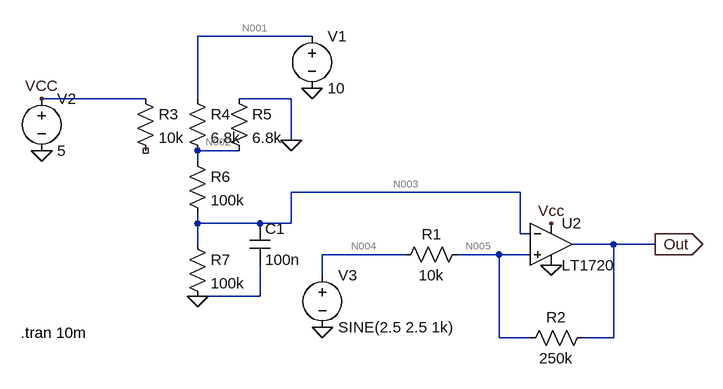
[diagram p0: schematic ConfNInv.asc]
ConfNInv.asc, the LTspice schematic file:
Version 4
SHEET 1 1800 752
WIRE 208 -96 32 -96
WIRE -48 0 -208 0
WIRE 32 0 32 -96
WIRE 176 0 96 0
WIRE 176 64 176 0
WIRE 96 80 32 80
WIRE 32 96 32 80
WIRE 528 144 176 144
WIRE 32 192 32 176
WIRE 128 192 32 192
WIRE 176 192 176 144
WIRE 176 192 128 192
WIRE 528 208 528 144
WIRE 544 208 528 208
WIRE 32 224 32 192
WIRE 672 224 608 224
WIRE 736 224 672 224
WIRE 352 240 224 240
WIRE 496 240 432 240
WIRE 544 240 496 240
WIRE 224 272 224 240
WIRE 128 304 128 256
WIRE 128 304 32 304
WIRE 496 368 496 240
WIRE 544 368 496 368
WIRE 672 368 672 224
WIRE 672 368 624 368
FLAG -208 80 0
FLAG -208 0 VCC
FLAG 576 192 Vcc
FLAG 576 256 0
FLAG 224 352 0
FLAG 736 224 Out
IOPIN 736 224 Out
FLAG 32 304 0
FLAG 208 -16 0
FLAG 176 64 0
SYMBOL voltage -208 -16 R0
WINDOW 123 0 0 Left 2
WINDOW 39 0 0 Left 2
SYMATTR InstName V2
SYMATTR Value 5
SYMBOL res 448 224 R90
WINDOW 0 0 56 VBottom 2
WINDOW 3 32 56 VTop 2
SYMATTR InstName R1
SYMATTR Value 10k
SYMBOL Comparators\\LT1720 576 160 R0
SYMATTR InstName U2
SYMBOL res 640 352 R90
WINDOW 0 0 56 VBottom 2
WINDOW 3 32 56 VTop 2
SYMATTR InstName R2
SYMATTR Value 250k
SYMBOL voltage 224 256 R0
WINDOW 123 0 0 Left 2
WINDOW 39 0 0 Left 2
SYMATTR InstName V3
SYMATTR Value SINE(2.5 2.5 1k)
SYMBOL res -64 -16 R0
SYMATTR InstName R3
SYMATTR Value 10k
SYMBOL res 16 -16 R0
SYMATTR InstName R4
SYMATTR Value 6.8k
SYMBOL res 80 -16 R0
SYMATTR InstName R5
SYMATTR Value 6.8k
SYMBOL res 16 80 R0
SYMATTR InstName R6
SYMATTR Value 100k
SYMBOL res 16 208 R0
SYMATTR InstName R7
SYMATTR Value 100k
SYMBOL voltage 208 -112 R0
WINDOW 123 0 0 Left 2
WINDOW 39 0 0 Left 2
SYMATTR InstName V1
SYMATTR Value 10
SYMBOL cap 112 192 R0
SYMATTR InstName C1
SYMATTR Value 100n
TEXT -240 360 Left 2 !.tran 10m

The netlist it stands for:
* ConfNInv.asc
V2 VCC 0 5
R1 N005 N004 10k
XU2 N005 N003 VCC 0 Out LT1720  ; pins In+ In- V+ V- OUT
R2 Out N005 250k
V3 N004 0 SINE(2.5 2.5 1k)
R3 VCC NC_01 10k
R4 N001 N002 6.8k
R5 0 N002 6.8k
R6 N002 N003 100k
R7 N003 0 100k
V1 N001 0 10
C1 N003 0 100n
.tran 10m
.lib LT1720.sub
.backanno
.end

* Results of the author's LTspice run, read from the files saved beside the schematic
* Operating Point, zero values left out:
*   V(vcc) = 5 V
*   V(n005) = 2.454 V
*   V(n004) = 2.5 V
*   V(n003) = 2.482 V
*   V(out) = 173 mV
*   V(n001) = 10 V
*   V(n002) = 4.917 V
*   I(R7) = 24.82 µA
*   I(R6) = 24.35 µA
*   I(R5) = -723.1 µA
*   I(R4) = 747.5 µA
*   I(R2) = -9.124 µA
*   I(R1) = -4.597 µA
*   I(V1) = -747.5 µA
*   I(V3) = -4.597 µA
*   I(V2) = -4 mA
*   Ix(u2:1) = -4.527 µA
*   Ix(u2:2) = -473.2 nA
*   Ix(u2:3) = 4 mA
*   Ix(u2:4) = -4.005 mA
*   Ix(u2:5) = 9.124 µA
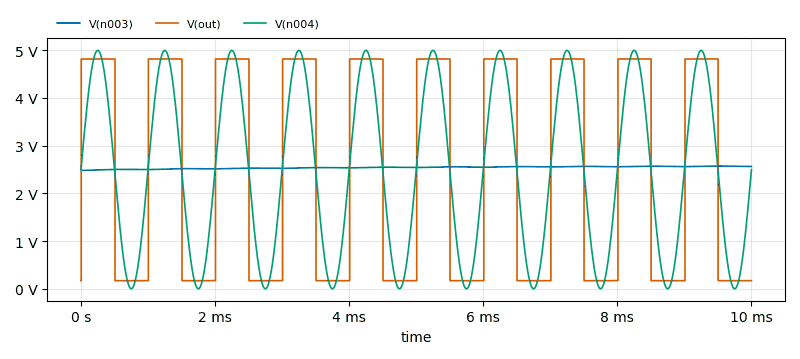
[diagram p1: Transient Analysis of ConfNInv.asc, plotted from the saved traces]
* Transient Analysis, 1 run:
*   V(n003): min 2.482 V, max 2.576 V, average 2.543 V, rms 2.543 V, last 2.565 V
*   V(out): min 171.3 mV, max 4.819 V, average 2.484 V, rms 3.401 V, last 173 mV
*   V(n004): min 2.352 mV, max 4.998 V, average 2.5 V, rms 3.062 V, last 2.5 V